# Altium project CAN.PrjPcb
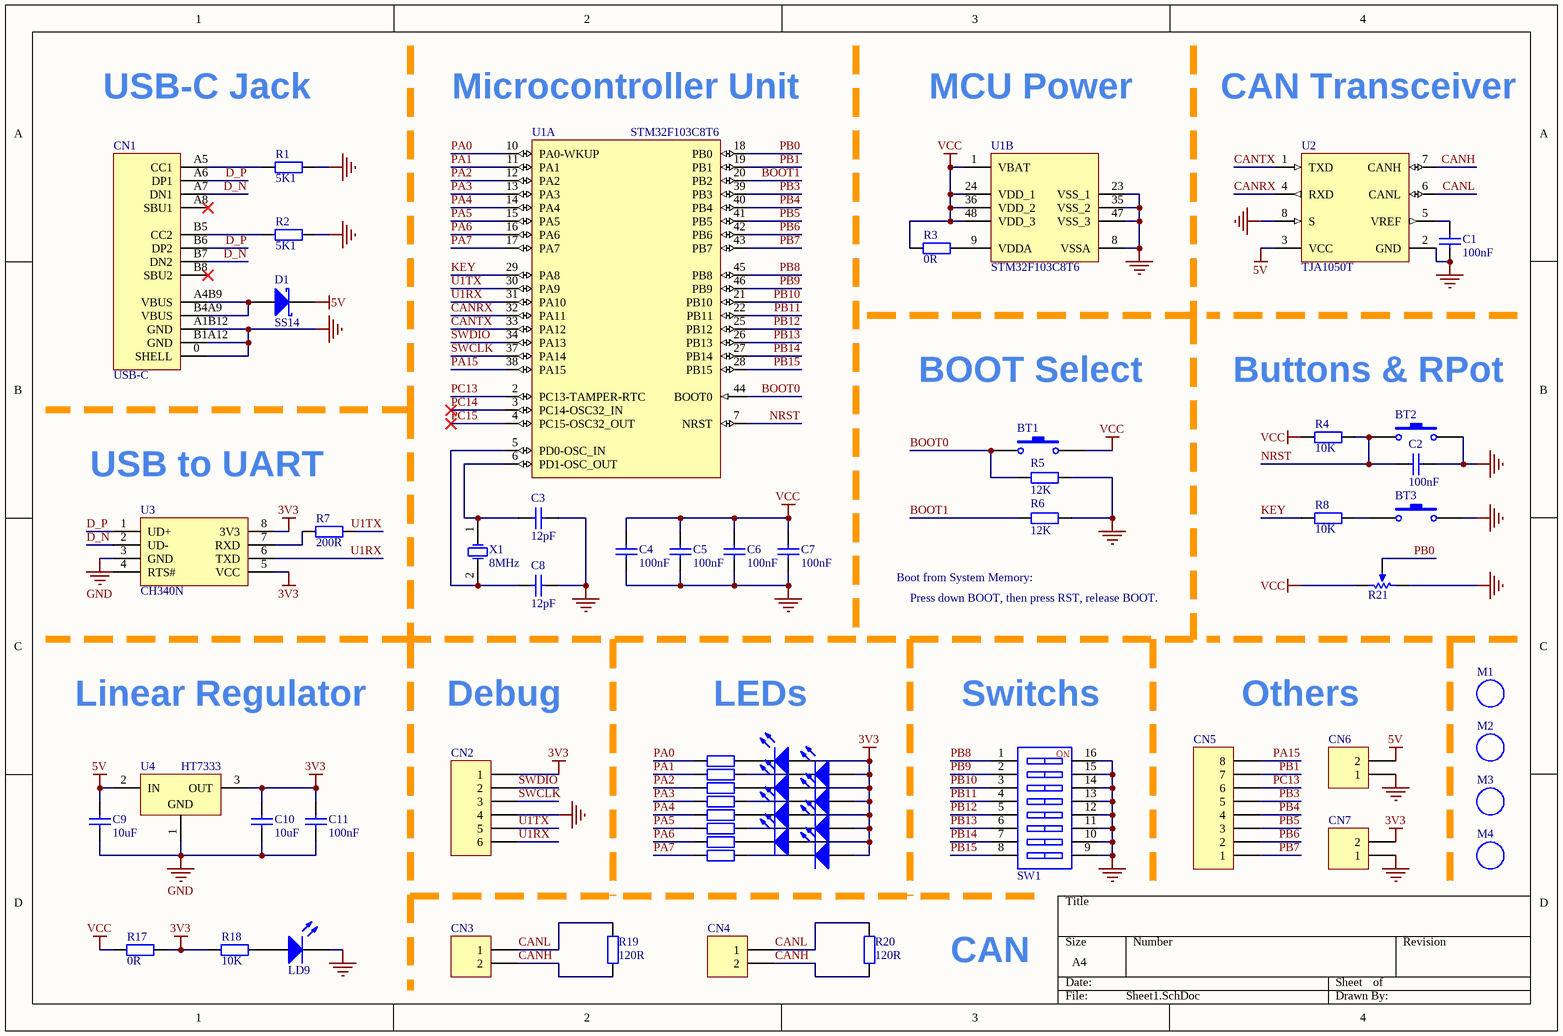
[diagram p0: Sheet1.SchDoc]
1 sheet, 62 parts. Net scope: global (net labels, ports and power ports of the same name join across sheets).
Board file: PCB1.PcbDoc

## Sheet Sheet1.SchDoc
size A4

### Parts
BT1  SW-PB  [TSW SMD-3*4*2.5]  (value not drawn)
BT2  SW-PB  [TSW SMD-3*6*2.5]  (value not drawn)
BT3  SW-PB  [TSW SMD-3*6*2.5]  (value not drawn)
C1  value 100nF  [C 0603]  (hidden comment: Cap)
C2  value 100nF  [C 0603]  (hidden comment: Cap)
C3  value 12pF  [C 0603]  (hidden comment: Cap)
C4  value 100nF  [C 0603]  (hidden comment: Cap)
C5  value 100nF  [C 0603]  (hidden comment: Cap)
C6  value 100nF  [C 0603]  (hidden comment: Cap)
C7  value 100nF  [C 0603]  (hidden comment: Cap)
C8  value 12pF  [C 0603]  (hidden comment: Cap)
C9  value 10uF  [C 0603]  (hidden comment: Cap)
C10  value 10uF  [C 0603]  (hidden comment: Cap)
C11  value 100nF  [C 0603]  (hidden comment: Cap)
CN1  USB-C  [USB-C/S_C_BCP16]
CN2  Header 6  [XH2.54-6P_H]  (value not drawn)
CN3  Header 2  [XH2.54-2P_H]  (value not drawn)
CN4  Header 2  [XH2.54-2P_H]  (value not drawn)
CN5  Header 8  [HDR1X8]  (value not drawn)
CN6  Header 2  [HDR1X2]  (value not drawn)
CN7  Header 2  [HDR1X2]  (value not drawn)
D1  SS14  [SMA]
LD1  150080SS75000  [0805_A]  (value not drawn)
LD2  150080SS75000  [0805_A]  (value not drawn)
LD3  150080SS75000  [0805_A]  (value not drawn)
LD4  150080SS75000  [0805_A]  (value not drawn)
LD5  150080SS75000  [0805_A]  (value not drawn)
LD6  150080SS75000  [0805_A]  (value not drawn)
LD7  150080SS75000  [0805_A]  (value not drawn)
LD8  150080SS75000  [0805_A]  (value not drawn)
LD9  150080SS75000  [0805_A]  (value not drawn)
M1  M3  [M3 125X200]  (value not drawn)
M2  M3  [M3 125X200]  (value not drawn)
M3  M3  [M3 125X200]  (value not drawn)
M4  M3  [M3 125X200]  (value not drawn)
R1  value 5K1  [R 0805]  (hidden comment: Res2)
R2  value 5K1  [R 0805]  (hidden comment: Res2)
R3  value 0R  [R 0805]  (hidden comment: Res2)
R4  value 10K  [R 0805]  (hidden comment: Res2)
R5  12K  [R 0805]
R6  12K  [R 0805]
R7  value 200R  [R 0805]  (hidden comment: Res2)
R8  value 10K  [R 0805]  (hidden comment: Res2)
R9  Res2  [R 0805]  (value not drawn)
R10  Res2  [R 0805]  (value not drawn)
R11  Res2  [R 0805]  (value not drawn)
R12  Res2  [R 0805]  (value not drawn)
R13  Res2  [R 0805]  (value not drawn)
R14  Res2  [R 0805]  (value not drawn)
R15  Res2  [R 0805]  (value not drawn)
R16  Res2  [R 0805]  (value not drawn)
R17  value 0R  [R 0805]  (hidden comment: Res2)
R18  value 10K  [R 0805]  (hidden comment: Res2)
R19  value 120R  [R 0805]  (hidden comment: Res2)
R20  value 120R  [R 0805]  (hidden comment: Res2)
R21  RPot  [RM065]  (value not drawn)
SW1  CSW-8P  [CSW DIP-8P]  (value not drawn)
U1  STM32F103C8T6  [STM-LQFP48_L]  (parts A,B of 2)
U2  TJA1050T  [NXP-SOT96-1_M]
U3  CH340N  [SOP8_N]
U4  HT7333  [SOT89_N]
X1  8MHz  [ABRA-ABM3-2_V]

### Nets
3V3: C10.1 C11.1 CN2.1 CN7.2 LD1.2(A) LD2.2(A) LD3.2(A) LD4.2(A) LD5.2(A) LD6.2(A) LD7.2(A) LD8.2(A) R17.1 R18.2 U3.5(VCC) U3.8(3V3) U4.3(OUT)
5V: C9.1 CN6.2 D1.2(K) U2.3(VCC) U4.2(IN)
GND: BT2.2 BT3.2 C1.2 C2.1 C3.2 C4.1 C5.1 C6.1 C7.1 C8.2 C9.2 C10.2 C11.2 CN1.0(SHELL) CN1.A1B12(GND) CN1.B1A12(GND) CN2.4 CN6.1 CN7.1 LD9.1(K) R1.2 R2.2 R5.2 R6.2 R21.2(BOT) SW1.9 SW1.10 SW1.11 SW1.12 SW1.13 SW1.14 SW1.15 SW1.16 U1.8(VSSA) U1.23(VSS_1) U1.35(VSS_2) U1.47(VSS_3) U2.2(GND) U2.8(S) U3.3(GND) U4.1(GND)
VCC: BT1.1 C4.2 C5.2 C6.2 C7.2 R3.1 R4.1 R17.2 R21.1(TOP) U1.1(VBAT) U1.24(VDD_1) U1.36(VDD_2) U1.48(VDD_3)
BOOT0: BT1.2 R5.1 U1.44(BOOT0)
BOOT1: R6.1 U1.20(PB2)
CANH: CN3.2 CN4.2 R19.1 R20.1 U2.7(CANH)
CANL: CN3.1 CN4.1 R19.2 R20.2 U2.6(CANL)
CANRX: U1.32(PA11) U2.4(RXD)
CANTX: U1.33(PA12) U2.1(TXD)
D_N: CN1.A7(DN1) CN1.B7(DN2) U3.2(UD-)
D_P: CN1.A6(DP1) CN1.B6(DP2) U3.1(UD+)
KEY: R8.1 U1.29(PA8)
NRST: BT2.1 C2.2 R4.2 U1.7(NRST)
PA0: R9.2 U1.10(PA0-WKUP)
PA1: R10.2 U1.11(PA1)
PA2: R11.2 U1.12(PA2)
PA3: R12.2 U1.13(PA3)
PA4: R13.2 U1.14(PA4)
PA5: R14.2 U1.15(PA5)
PA6: R15.2 U1.16(PA6)
PA7: R16.2 U1.17(PA7)
PA15: CN5.8 U1.38(PA15)
PB0: R21.3(TAP) U1.18(PB0)
PB1: CN5.7 U1.19(PB1)
PB3: CN5.5 U1.39(PB3)
PB4: CN5.4 U1.40(PB4)
PB5: CN5.3 U1.41(PB5)
PB6: CN5.2 U1.42(PB6)
PB7: CN5.1 U1.43(PB7)
PB8: SW1.1 U1.45(PB8)
PB9: SW1.2 U1.46(PB9)
PB10: SW1.3 U1.21(PB10)
PB11: SW1.4 U1.22(PB11)
PB12: SW1.5 U1.25(PB12)
PB13: SW1.6 U1.26(PB13)
PB14: SW1.7 U1.27(PB14)
PB15: SW1.8 U1.28(PB15)
PC13: CN5.6 U1.2(PC13-TAMPER-RTC)
PC14: U1.3(PC14-OSC32_IN)
PC15: U1.4(PC15-OSC32_OUT)
SWCLK: CN2.3 U1.37(PA14)
SWDIO: CN2.2 U1.34(PA13)
U1RX: CN2.6 U1.31(PA10) U3.6(TXD)
U1TX: CN2.5 R7.2 U1.30(PA9)
NetBT3_1: BT3.1 R8.2
NetC1_1: C1.1 U2.5(VREF)
NetC3_1: C3.1 U1.6(PD1-OSC_OUT) X1.1(X1)
NetC8_1: C8.1 U1.5(PD0-OSC_IN) X1.2(X2)
NetCN1_A4B9: CN1.A4B9(VBUS) CN1.B4A9(VBUS) D1.1(A)
NetCN1_A5: CN1.A5(CC1) R1.1
NetCN1_B5: CN1.B5(CC2) R2.1
NetLD1_1: LD1.1(K) R9.1
NetLD2_1: LD2.1(K) R10.1
NetLD3_1: LD3.1(K) R11.1
NetLD4_1: LD4.1(K) R12.1
NetLD5_1: LD5.1(K) R13.1
NetLD6_1: LD6.1(K) R14.1
NetLD7_1: LD7.1(K) R15.1
NetLD8_1: LD8.1(K) R16.1
NetLD9_2: LD9.2(A) R18.1
NetR3_2: R3.2 U1.9(VDDA)
NetR7_1: R7.1 U3.7(RXD)

Not connected (* = marked no-connect by the designer): CN1 A8(SBU1)* B8(SBU2)*; U3 4(RTS#)

### Notes on the sheet
- USB-C Jack
- (near U1) Microcontroller Unit
- MCU Power
- CAN Transceiver
- BOOT Select
- Buttons & RPot
- USB to UART
- Boot from System Memory:
- Press down BOOT, then press RST, release BOOT.
- Linear Regulator
- Debug
- LEDs
- (near SW1) Switchs
- Others
- CAN
- (in symbol CSW-8P) NO

### Library data of the parts
BT1-BT3 = SW-PB: Switch; Published: 24-Mar-1999; LatestRevisionDate: 17-Jul-2002; LatestRevisionNote: Re-released for DXP Platform.; PackageReference: SPST-2; Publisher: Altium Limited; PackageDescription: Switch; 2 Leads
C1-C11 = Cap: Capacitor; Published: 8-Jun-2000; LatestRevisionDate: 17-Jul-2002; LatestRevisionNote: Re-released for DXP Platform.; PackageReference: RAD-0.3; Publisher: Altium Limited; PackageDescription: Radial Cap, Thru-Hole; 2 Leads; 0.3 in Pin Spacing
CN1 = USB-C/16-Pin: USB-C型母接口
CN2 = Header 6: Header, 6-Pin; LatestRevisionDate: 17-Jul-2002; LatestRevisionNote: Re-released for DXP Platform.; Publisher: Altium Limited
CN3 CN4 CN6 CN7 = Header 2: Header, 2-Pin; LatestRevisionDate: 17-Jul-2002; LatestRevisionNote: Re-released for DXP Platform.; Publisher: Altium Limited
CN5 = Header 8: Header, 8-Pin; LatestRevisionDate: 17-Jul-2002; LatestRevisionNote: Re-released for DXP Platform.; Publisher: Altium Limited
D1 = D Schottky: Schottky Diode; Published: 8-Jun-2000; LatestRevisionDate: 17-Jul-2002; LatestRevisionNote: Re-released for DXP Platform.; PackageReference: SMB; Publisher: Altium Limited; PackageDescription: DO-214-AA/SMB; 2 C-Bend Leads; Body 5.3 x 3.6 mm, inc. leads (LxW); Code_JEDEC: DO-214-AA
LD1-LD9 = CMP-1426-00010-1: SMD mono-color Chip LED, WL-SMCW, Super Red; Manufacturer: Wuerth Elektronik; PackageReference: 0805_A; ComponentLink2URL: http://katalog.we-online.com/led/datasheet/150080SS75000.pdf; ComponentLink1URL: http://www.we-online.com; Color: Super Red; ComponentLink2Description: Datasheet; ComponentLink1Description: Manufacturer URL; PartNumber: 150080SS75000
M1-M4 = M3: 铜柱孔; 版权归属: 源创客; BOM名称: 铜柱孔; 学习资源: www.ooocke.com
R1-R4 R7 R8 R17-R20 = Res2: Resistor; Published: 8-Jun-2000; LatestRevisionDate: 17-Jul-2002; LatestRevisionNote: Re-released for DXP Platform.; PackageReference: AXIAL-0.4; Publisher: Altium Limited; PackageDescription: Axial Device, Thru-Hole; 2 Leads; 0.4 in Pin Spacing
R5 R6 = R: 贴片电阻; 版权归属: 源创客; BOM名称: 贴片电阻; 学习资源: www.ooocke.com
R9-R16 = Res2: Resistor; Value: 10K; Published: 8-Jun-2000; LatestRevisionDate: 17-Jul-2002; LatestRevisionNote: Re-released for DXP Platform.; PackageReference: AXIAL-0.4; Publisher: Altium Limited; PackageDescription: Axial Device, Thru-Hole; 2 Leads; 0.4 in Pin Spacing
R21 = RPot: Potentiometer; pin to pad: 2>3 3>2; Sim Note: Enter the Resistance value and the set point into parameter fields.; Set Position: 0.5; Value: 1K; Published: 8-Jun-2000; LatestRevisionDate: 17-Jul-2002; LatestRevisionNote: Re-released for DXP Platform.; PackageReference: VR5; Publisher: Altium Limited; PackageDescription: Variable Resistor, Thru-Hole; 3 Leads
SW1 = CSW-8P: 8路编码开关; 版权归属: 源创客; BOM名称: 8路编码开关; 学习资源: www.ooocke.com
U1 = CMP-0237-00215-3: ARM Cortex-M3 32-bit MCU, 64 KB Flash, 20 KB Internal RAM, 37 I/Os, 48-pin LQFP, -40 to 85 degC, Tray; Supply Voltage(Vcc) min (V): 2; Internal RAM Size (kB): 20; FLASH Size (Prog) (kB): 64; A/D Converter: 2x12-bit (10 Channel); I/Os (High Current): 37; Operating Frequency(F) (Processor speed) (MHz): 72; Core: ARM Cortex-M3; ComponentLink3Description: Package Specification; Mounting Technology: Surface Mount; PartNumber: STM32F103C8T6; PackageReference: LQFP48; Packing: Tray; ComponentLink3URL: http://www.st.com/st-web-ui/static/active/en/resource/technical/document/datasheet/DM00058181.pdf; DatasheetVersion: Rev. 16; ComponentLink1URL: http://www.st.com/web/en/home.html; PackageVersion: Rev. 6, 06/2013; ComponentLink2URL: http://www.st.com/st-web-ui/static/active/en/resource/technical/document/datasheet/CD00161566.pdf; ComponentLink1Description: Manufacturer URL; ComponentLink2Description: Datasheet; PackageDescription: 48-Pin Low Profile Quad Flat Package, 7 x 7 mm Body, 0.5 mm Pitch
U2 = CMP-2000-04923-1: High speed CAN transceiver, 4.75 to 5.25 V, -40 to 150 degC, 8-Pin SO (SOT96-1), RoHS, Tape and Reel; Manufacturer: NXP Semiconductors; Duplex: Half; Number of Drivers/Receivers: 1/1; Product Training Modules: CANandLINBusTransceiver; Receiver Hysteresis: 70mV; Voltage - Supply: 4.75V~5.25V; Dynamic Catalog: CANTransceivers; Other Names: 568-10292-1; PCN Packaging: LighterPackingReels30/Mar/2014; PCN Obsolescence: TJA105028/Apr/2013 / MultipleDevices19/Apr/2013; Standard Package: 1; Family: Interface-Drivers,Receivers,Transceivers; Package Reference: SOT96-1; Mounting Type: SurfaceMount; Package / Case: 8-SOIC(0.154",3.90mmWidth); Package Description: 8-Pin Small Outline Integrated Circuit, Body 4.9 x 3.9 mm, Pitch 1.27 mm; Protocol: CAN; Package/Case: 8-SOIC(0.154",3.90mmWidth); Supplier Device Package: 8-SO; <PCN>: http://media.digikey.com/pdf/PCNs/NXP/201209019F04_TJA1050_Obs.pdf; Minimum Quantity: Transceiver; Datasheet URL: http://www.nxp.com/documents/data_sheet/TJA1050.pdf; Category: IntegratedCircuits(ICs); Quantity Available: CutTape(CT)AlternatePackaging; Datasheet Version: Rev. 4, 10/2003; Type: Transceiver; Packaging: CutTape(CT); Manufacturer URL: http://www.nxp.com/
U4 = CMP-0204-00157-1: Low Power Consumption LDO, Output Voltage 3.3V, SOT89 Pkg; DatasheetVersion: Rev1.4, Jan-2006; PackageVersion: May-2010; PackageReference: SOT89; Code_IPC: SOT89; PackageDescription: 3-Pin SOT-89 Package 1.5 mm Pitch, 4.1 mm Lead Span
X1 = CMP-2000-05033-1: Miniature Ceramic Crystal, 8 MHz, -40 to 85 degC, 2-Pin SMD, RoHS, Tape and Reel; Manufacturer: ABRACON; Case Length: 5mm; Case Width: 3.2mm; Case Height: 1.3mm; Load Capacitance: 18pF; Frequency Stability: 30PPM; ESR: 140Ohms; Tolerance: 20PPM; Type: MiniatureCeramicCrystal; Factory Pack Quantity: 1000; Package / Case: 5mmx3.2mm; Mounting Style: SMD/SMT; Manufacturer URL: http://www.abracon.com/; RoHS: Details; Frequency: 8MHz; Dimensions: 3.2mmWx5mmLx1.3mmH; Datasheet URL: http://www.farnell.com/datasheets/1754353.pdf; Brand: ABRACON; Packaging: Reel; Product Category: Crystals; Package Description: 2-Pin Surface Mount Device, Body 5 x 3.2 mm; Package URL: http://www.abracon.com/Support/PackageDrawing/Resonators/ABM3.PDF; Operating Temperature Range: -40Cto+85C; Termination Style: SMD/SMT; Datasheet Version: Sep-13; Series: ABM3; Package Reference: ABM3-2